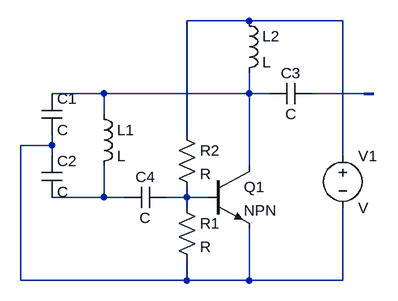
[diagram p0: schematic Draft1.asc]
Draft1.asc, the LTspice schematic file:
Version 4
SHEET 1 880 680
WIRE 320 16 224 16
WIRE 464 16 320 16
WIRE 96 128 16 128
WIRE 320 128 320 96
WIRE 320 128 96 128
WIRE 352 128 320 128
WIRE 496 128 416 128
WIRE 96 160 96 128
WIRE 224 192 224 16
WIRE 16 208 16 192
WIRE 16 208 -32 208
WIRE 16 224 16 208
WIRE 464 224 464 16
WIRE 320 240 320 128
WIRE 96 288 96 240
WIRE 96 288 16 288
WIRE 128 288 96 288
WIRE 224 288 224 272
WIRE 224 288 192 288
WIRE 256 288 224 288
WIRE 224 304 224 288
WIRE -32 416 -32 208
WIRE 224 416 224 384
WIRE 224 416 -32 416
WIRE 320 416 320 336
WIRE 320 416 224 416
WIRE 464 416 464 304
WIRE 464 416 320 416
BUSTAP 496 128 512 128
SYMBOL cap 0 128 R0
SYMATTR InstName C1
SYMBOL cap 0 224 R0
SYMATTR InstName C2
SYMBOL cap 416 112 R90
WINDOW 0 0 32 VBottom 2
WINDOW 3 32 32 VTop 2
SYMATTR InstName C3
SYMBOL cap 192 272 R90
WINDOW 0 0 32 VBottom 2
WINDOW 3 32 32 VTop 2
SYMATTR InstName C4
SYMBOL ind 80 144 R0
SYMATTR InstName L1
SYMBOL ind 304 0 R0
SYMATTR InstName L2
SYMBOL res 208 288 R0
SYMATTR InstName R1
SYMBOL res 208 176 R0
SYMATTR InstName R2
SYMBOL npn 256 240 R0
SYMATTR InstName Q1
SYMBOL voltage 464 208 R0
SYMATTR InstName V1

The netlist it stands for:
* Draft1.asc
C1 N002 N004 C
C2 N004 N005 C
C3 N003 N002 C
C4 N006 N005 C
L1 N002 N005 L
L2 N001 N002 L
R1 N006 N004 R
R2 N001 N006 R
Q1 N002 N006 N004 0 NPN
V1 N001 N004 V
.model NPN NPN
.model PNP PNP
.lib standard.bjt
.backanno
.end